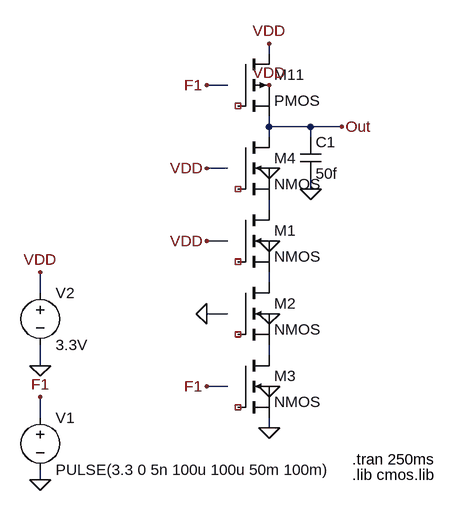
[diagram p0: schematic pe_nand_charge_sharing_and_leakage.asc]
pe_nand_charge_sharing_and_leakage.asc, the LTspice schematic file:
Version 4
SHEET 1 1292 680
WIRE -1488 -624 -1488 -640
WIRE -1552 -576 -1584 -576
WIRE -1488 -512 -1488 -528
WIRE -1424 -512 -1488 -512
WIRE -1376 -512 -1424 -512
WIRE -1488 -496 -1488 -512
WIRE -1424 -496 -1424 -512
WIRE -1552 -448 -1584 -448
WIRE -1424 -416 -1424 -432
WIRE -1488 -384 -1488 -400
WIRE -1552 -336 -1584 -336
WIRE -1488 -272 -1488 -288
WIRE -1840 -256 -1840 -288
WIRE -1552 -224 -1584 -224
WIRE -1488 -160 -1488 -176
WIRE -1840 -144 -1840 -176
WIRE -1552 -112 -1584 -112
WIRE -1840 -64 -1840 -96
WIRE -1488 -48 -1488 -64
WIRE -1840 32 -1840 16
FLAG -1488 -48 0
FLAG -1584 -112 F1
FLAG -1840 -144 0
FLAG -1840 32 0
FLAG -1840 -288 VDD
FLAG -1840 -96 F1
FLAG -1376 -512 Out
FLAG -1488 -640 VDD
FLAG -1584 -576 F1
FLAG -1424 -416 0
FLAG -1488 -448 0
FLAG -1488 -336 0
FLAG -1488 -224 0
FLAG -1488 -112 0
FLAG -1488 -576 VDD
FLAG -1584 -224 0
FLAG -1584 -448 VDD
FLAG -1584 -336 VDD
SYMBOL pmos -1536 -624 R0
SYMATTR InstName M11
SYMATTR Value2 l=0.6u w=3u
SYMBOL voltage -1840 -80 R0
WINDOW 123 0 0 Left 2
WINDOW 39 0 0 Left 2
SYMATTR InstName V1
SYMATTR Value PULSE(3.3 0 5n 100u 100u 50m 100m)
SYMBOL voltage -1840 -272 R0
WINDOW 123 0 0 Left 2
WINDOW 39 0 0 Left 2
SYMATTR InstName V2
SYMATTR Value 3.3V
SYMBOL nmos -1536 -384 R0
SYMATTR InstName M1
SYMATTR SpiceModel ""
SYMATTR Value NMOS
SYMATTR Value2 l=0.6u w=4.5u
SYMBOL nmos -1536 -272 R0
SYMATTR InstName M2
SYMATTR SpiceModel ""
SYMATTR Value NMOS
SYMATTR Value2 l=0.6u w=4.5u
SYMBOL nmos -1536 -160 R0
SYMATTR InstName M3
SYMATTR SpiceModel ""
SYMATTR Value NMOS
SYMATTR Value2 l=0.6u w=4.5u
SYMBOL nmos -1536 -496 R0
SYMATTR InstName M4
SYMATTR SpiceModel ""
SYMATTR Value NMOS
SYMATTR Value2 l=0.6u w=4.5u
SYMBOL cap -1440 -496 R0
SYMATTR InstName C1
SYMATTR Value 50f
TEXT -1360 24 Left 2 !.lib cmos.lib
TEXT -1360 0 Left 2 !.tran 250ms

The netlist it stands for:
* pe_nand_charge_sharing_and_leakage.asc
* M11: PMOS l=0.6u w=3u (symbol pmos not certain, pin order unknown); nets seen at it: Out, VDD
V1 F1 0 PULSE(3.3 0 5n 100u 100u 50m 100m)
V2 VDD 0 3.3V
* M1: NMOS l=0.6u w=4.5u (symbol nmos not certain, pin order unknown); nets seen at it: N001, N002
* M2: NMOS l=0.6u w=4.5u (symbol nmos not certain, pin order unknown); nets seen at it: N002, N003
* M3: NMOS l=0.6u w=4.5u (symbol nmos not certain, pin order unknown); nets seen at it: 0, N003
* M4: NMOS l=0.6u w=4.5u (symbol nmos not certain, pin order unknown); nets seen at it: N001, Out
C1 Out 0 50f
.lib cmos.lib
.tran 250ms
.backanno
.end